# EasyEDA Pro project ProPrj_FinalPatch Design_2026-07-16.epro

# Schematic Schematic1
Board Name: Board1; Create Date: 2026-05-11; Page Name: P1; Project Name: FinalPatch Design; Schematic Name: Schematic1; Update Date: 2026-05-14; Company: EasyEDA.com; Page Size: A4; Version: V1.0
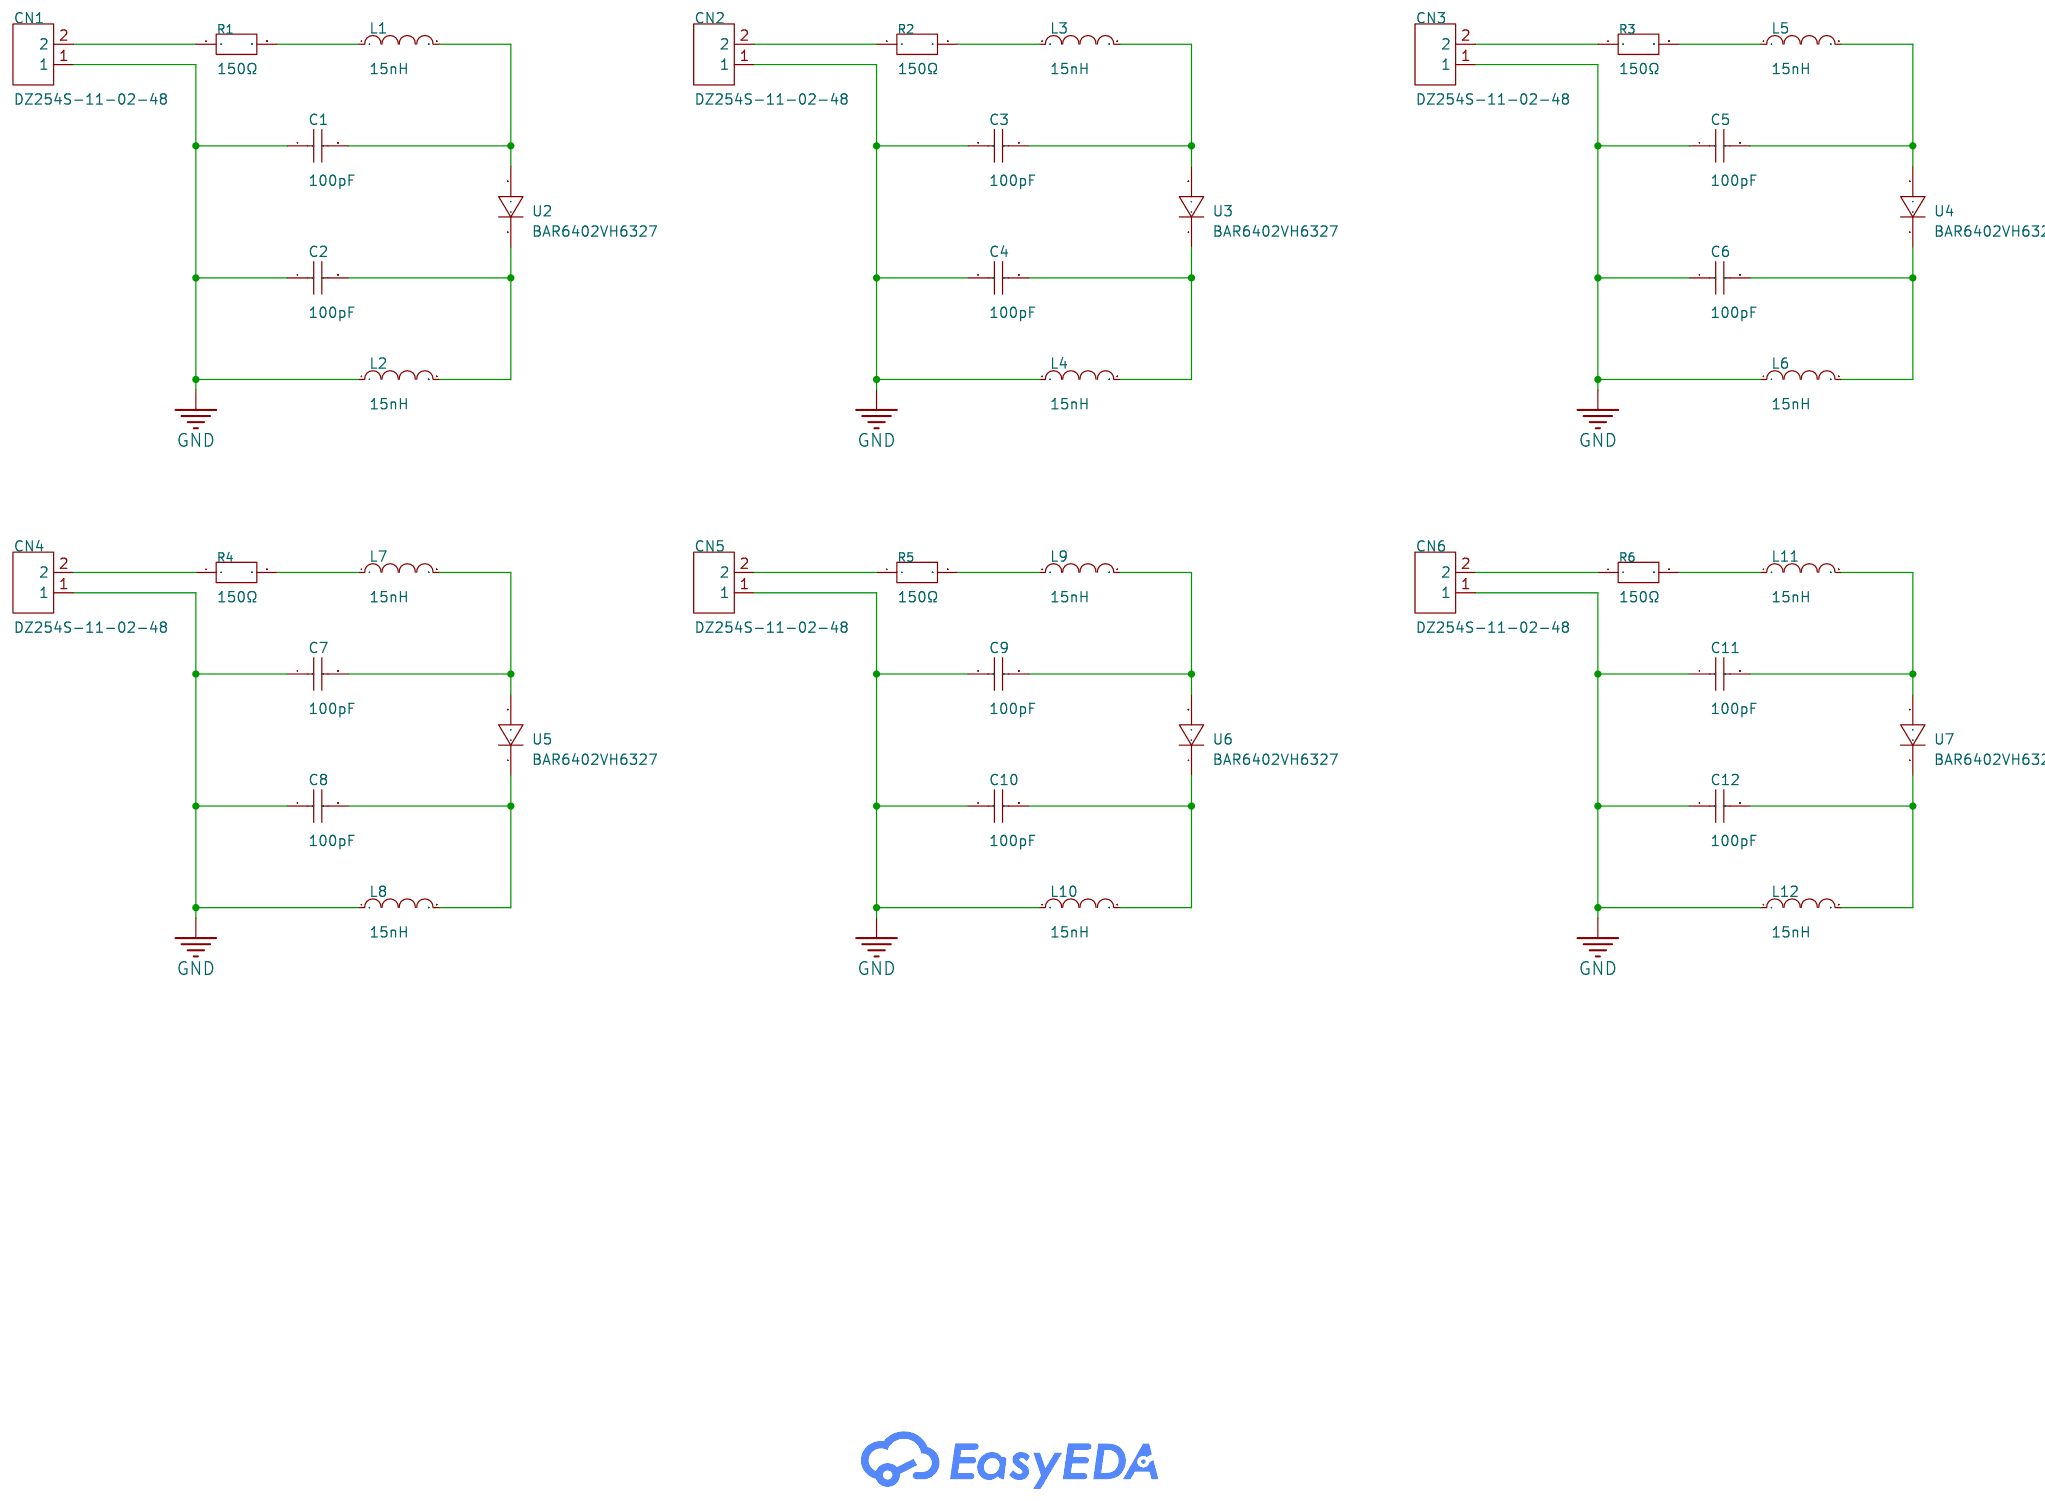
[diagram p0: schematic sheet]

## Parts
C1  100pF  [C0402]
C2  100pF  [C0402]
C3  100pF  [C0402]
C4  100pF  [C0402]
C5  100pF  [C0402]
C6  100pF  [C0402]
C7  100pF  [C0402]
C8  100pF  [C0402]
C9  100pF  [C0402]
C10  100pF  [C0402]
C11  100pF  [C0402]
C12  100pF  [C0402]
CN1  DZ254S-11-02-48  [HDR-SMD_2P-P2.54-LS4.8]
CN2  DZ254S-11-02-48  [HDR-SMD_2P-P2.54-LS4.8]
CN3  DZ254S-11-02-48  [HDR-SMD_2P-P2.54-LS4.8]
CN4  DZ254S-11-02-48  [HDR-SMD_2P-P2.54-LS4.8]
CN5  DZ254S-11-02-48  [HDR-SMD_2P-P2.54-LS4.8]
CN6  DZ254S-11-02-48  [HDR-SMD_2P-P2.54-LS4.8]
L1  15nH  [IND-SMD_L1.0-W0.6]
L2  15nH  [IND-SMD_L1.0-W0.6]
L3  15nH  [IND-SMD_L1.0-W0.6]
L4  15nH  [IND-SMD_L1.0-W0.6]
L5  15nH  [IND-SMD_L1.0-W0.6]
L6  15nH  [IND-SMD_L1.0-W0.6]
L7  15nH  [IND-SMD_L1.0-W0.6]
L8  15nH  [IND-SMD_L1.0-W0.6]
L9  15nH  [IND-SMD_L1.0-W0.6]
L10  15nH  [IND-SMD_L1.0-W0.6]
L11  15nH  [IND-SMD_L1.0-W0.6]
L12  15nH  [IND-SMD_L1.0-W0.6]
R1  150Ω  [R0603]
R2  150Ω  [R0603]
R3  150Ω  [R0603]
R4  150Ω  [R0603]
R5  150Ω  [R0603]
R6  150Ω  [R0603]
U2  BAR6402VH6327  [SC-79_L1.2-W0.8-LS1.6-RD]
U3  BAR6402VH6327  [SC-79_L1.2-W0.8-LS1.6-RD]
U4  BAR6402VH6327  [SC-79_L1.2-W0.8-LS1.6-RD]
U5  BAR6402VH6327  [SC-79_L1.2-W0.8-LS1.6-RD]
U6  BAR6402VH6327  [SC-79_L1.2-W0.8-LS1.6-RD]
U7  BAR6402VH6327  [SC-79_L1.2-W0.8-LS1.6-RD]

## Library data of the parts
C1-C12 = GRM1555C1H101JA01D: Capacitance:100pF Tolerance:±5% Tolerance:±5% Voltage Rating:50V Temperature Coefficient:C0G; LCSC Part Name: 100pF ±5% 50V; Supplier Part: C77177; Manufacturer: muRata(村田); Supplier Footprint: 0402; Datasheet: https://item.szlcsc.com/datasheet/GRM1555C1H101JA01D/78305.html; Supplier: LCSC; Tolerance: ±5%; Voltage Rating: 50V; Temperature Coefficient: C0G
CN1-CN6 = DZ254S-11-02-48: Pin Structure:1x2P Pitch:2.54mm Circluar Pins/Square Pins:Pin Header Mounting Type:Surface Mount,Vertical Number of Rows:1 Number of Pins:2P Current Rating:3A Length of Mating Pin:6mm Insulation Height:2.54mm Contact Material:Brass Contact Plating:Gold Co; LCSC Part Name: 1x2P 间距:2.54mm 方针 立贴; Supplier Part: C5160785; Manufacturer: DEALON(德艺隆); Supplier Footprint: SMD,P=2.54mm; JLCPCB Part Class: Extended Part; Datasheet: https://item.szlcsc.com/datasheet/DZ254S-11-02-48/5807881.html; Supplier: LCSC; Pin Structure: 1x2P; Pitch: 2.54mm; Circluar Pins/Square Pins: Pin Header; Mounting Type: Surface Mount,Vertical; Number of Rows: 1; Number of Pins: 2P; Current Rating: 3A; Length of Mating Pin: 6mm; Insulation Height: 2.54mm; Contact Material: Brass; Contact Plating: Gold; Color: Black
L1-L12 = LQW15AN15NJ00D: Inductance: Tolerance:±5% Tolerance:±5% Rated Current: Saturation Current (Isat):- DC Resistance (DCR): Ratings:-; LCSC Part Name: 15nH ±5%; Supplier Part: C94079; Manufacturer: muRata(村田); Supplier Footprint: 0402; Datasheet: https://atta.szlcsc.com/upload/public/pdf/source/20170325/1490427896379.pdf; Supplier: LCSC; Tolerance: ±5%
R1-R6 = HP03W5F1500T5E: Type:Thick Film Resistor Resistance:150Ω Tolerance:±1% Tolerance:±1% Power(Watts):200mW Voltage-Supply(Max):75V Temperature Coefficient:±100ppm/℃ Temperature Coefficient:±100ppm/℃ Operating Temperature:-55℃~+155℃ Operating Temperature:-55℃~+155℃; LCSC Part Name: 150Ω ±1% 200mW 厚膜电阻; Supplier Part: C778412; Manufacturer: UNI-ROYAL(厚声); Supplier Footprint: 0603; Datasheet: https://item.szlcsc.com/datasheet/HP03W5F1500T5E/827056.html; Supplier: LCSC; Type: Thick Film Resistor; Tolerance: ±1%; Power(Watts): 200mW; Voltage-Supply(Max): 75V; Temperature Coefficient: ±100ppm/℃; Operating Temperature: -55℃~+155℃
U2-U7 = BAR6402VH6327: LCSC Part Name: 硅PIN二极管，高压电流控制射频电阻，频率范围1 MHz - 6 GHz; Supplier Part: C115495; Manufacturer: Infineon(英飞凌); Supplier Footprint: SC-79; JLCPCB Part Class: Extended Part; Datasheet: https://item.szlcsc.com/datasheet/BAR6402VH6327/116743.html; Supplier: LCSC

## Nets
GND: C1.1 C2.1 C3.1 C4.1 C5.1 C6.1 C7.1 C8.1 C9.1 C10.1 C11.1 C12.1 CN1.1 CN2.1 CN3.1 CN4.1 CN5.1 CN6.1 L2.1 L4.1 L6.1 L8.1 L10.1 L12.1
$1N3898: CN1.2 R1.1
$1N4274: C1.2 L1.2 U2.2(K)
$1N4289: L1.1 R1.2
$1N4357: C2.2 L2.2 U2.1(A)
$1N8168: L3.1 R2.2
$1N8170: C3.2 L3.2 U3.2(K)
$1N8175: C4.2 L4.2 U3.1(A)
$1N8189: CN2.2 R2.1
$1N8448: L5.1 R3.2
$1N8450: C5.2 L5.2 U4.2(K)
$1N8455: C6.2 L6.2 U4.1(A)
$1N8469: CN3.2 R3.1
$1N9242: L7.1 R4.2
$1N9244: C7.2 L7.2 U5.2(K)
$1N9249: C8.2 L8.2 U5.1(A)
$1N9263: CN4.2 R4.1
$1N9273: CN5.2 R5.1
$1N9274: C9.2 L9.2 U6.2(K)
$1N9279: C10.2 L10.2 U6.1(A)
$1N9284: L9.1 R5.2
$1N9286: C11.2 L11.2 U7.2(K)
$1N9291: C12.2 L12.2 U7.1(A)
$1N9305: L11.1 R6.2
$1N9307: CN6.2 R6.1

# Board PCB1
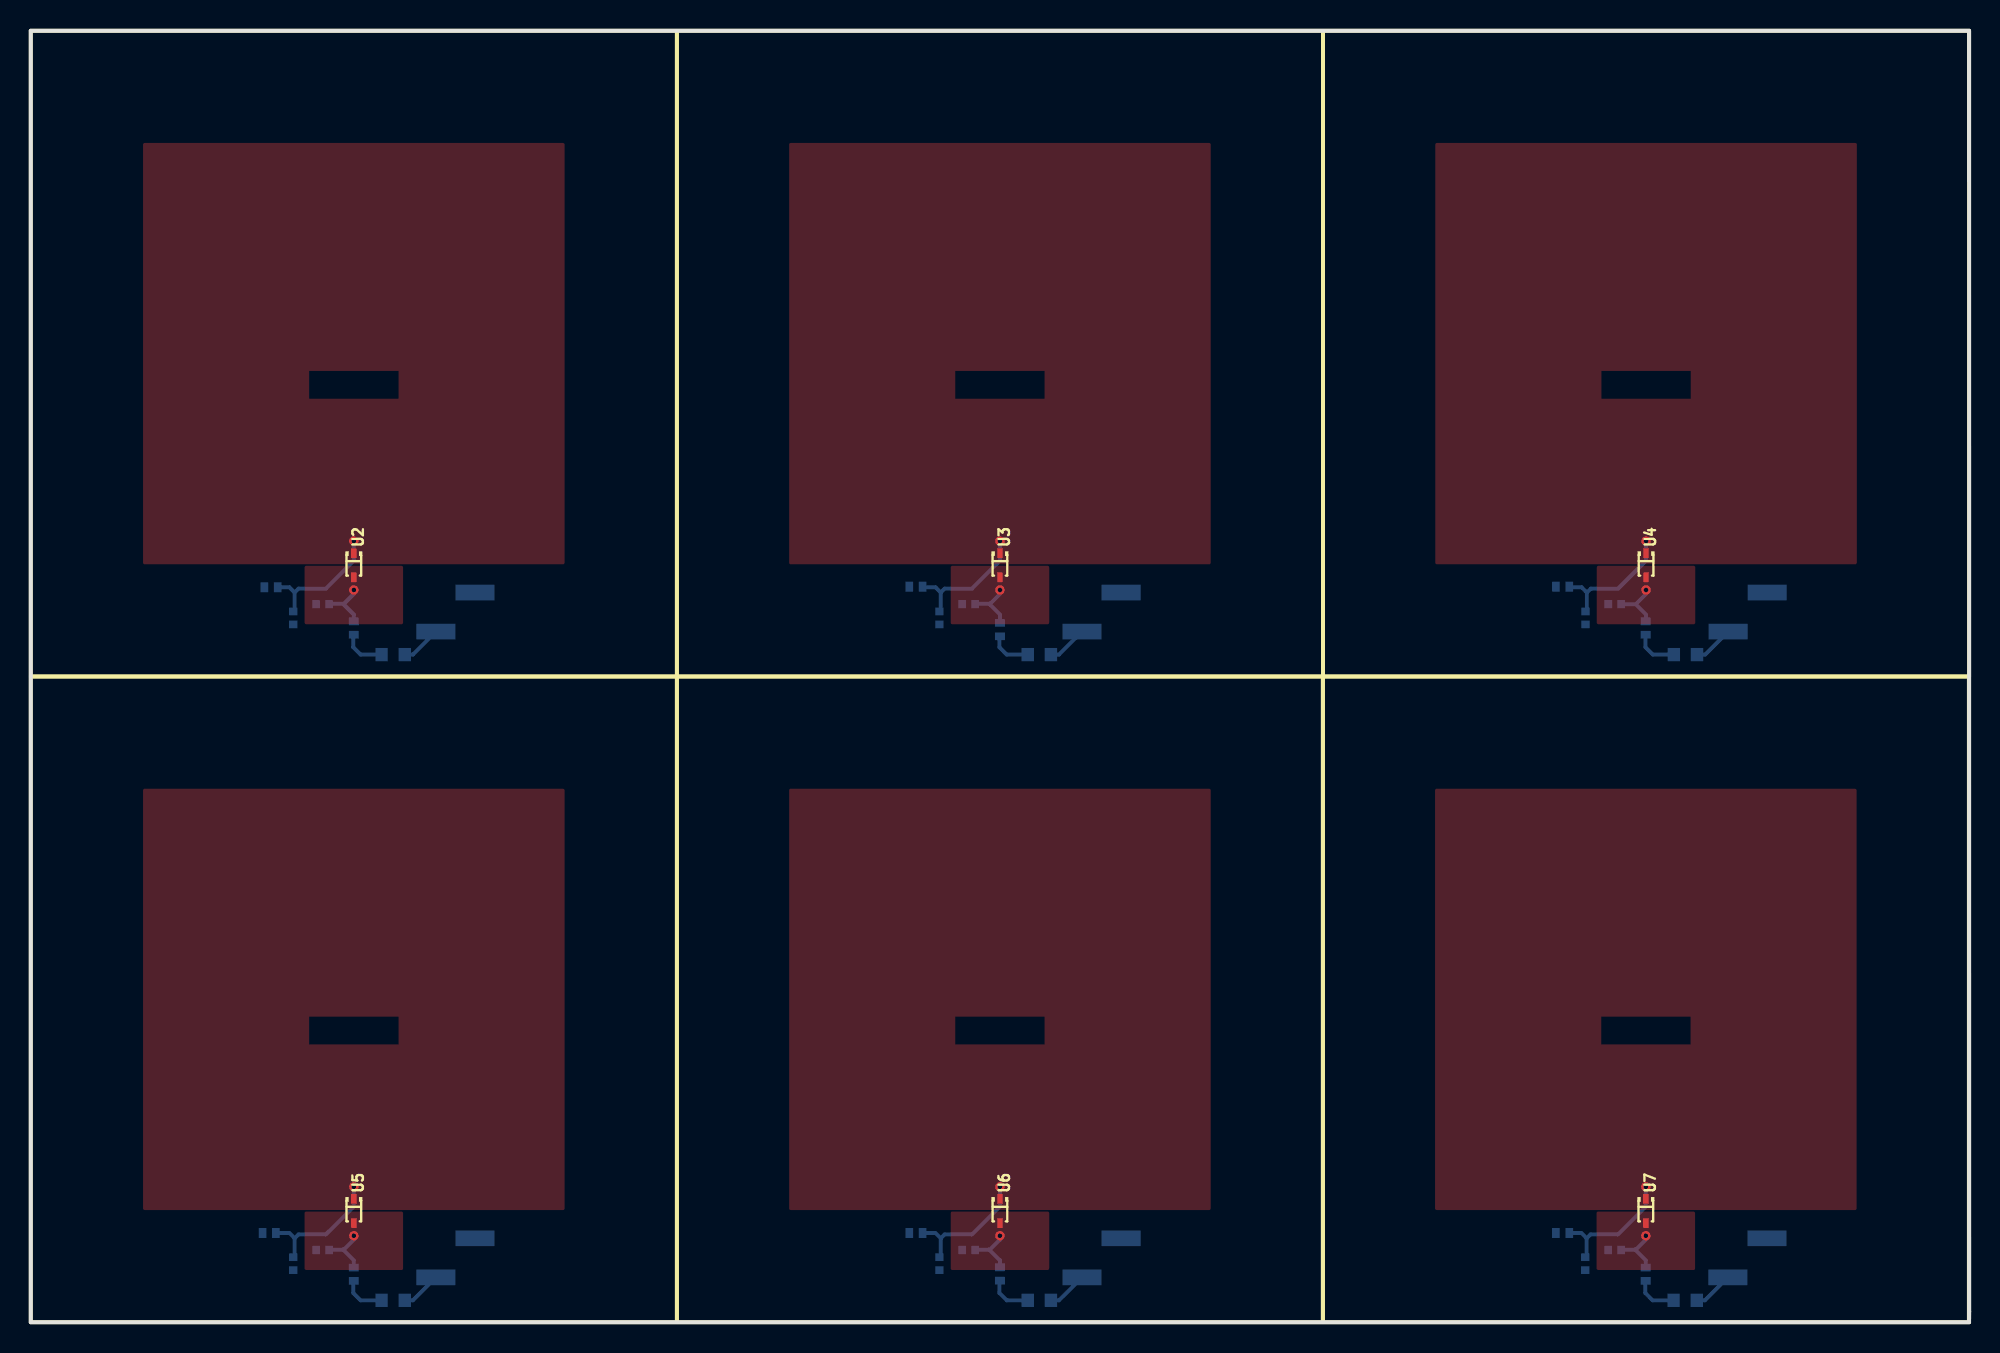
[diagram p1: board, top side]
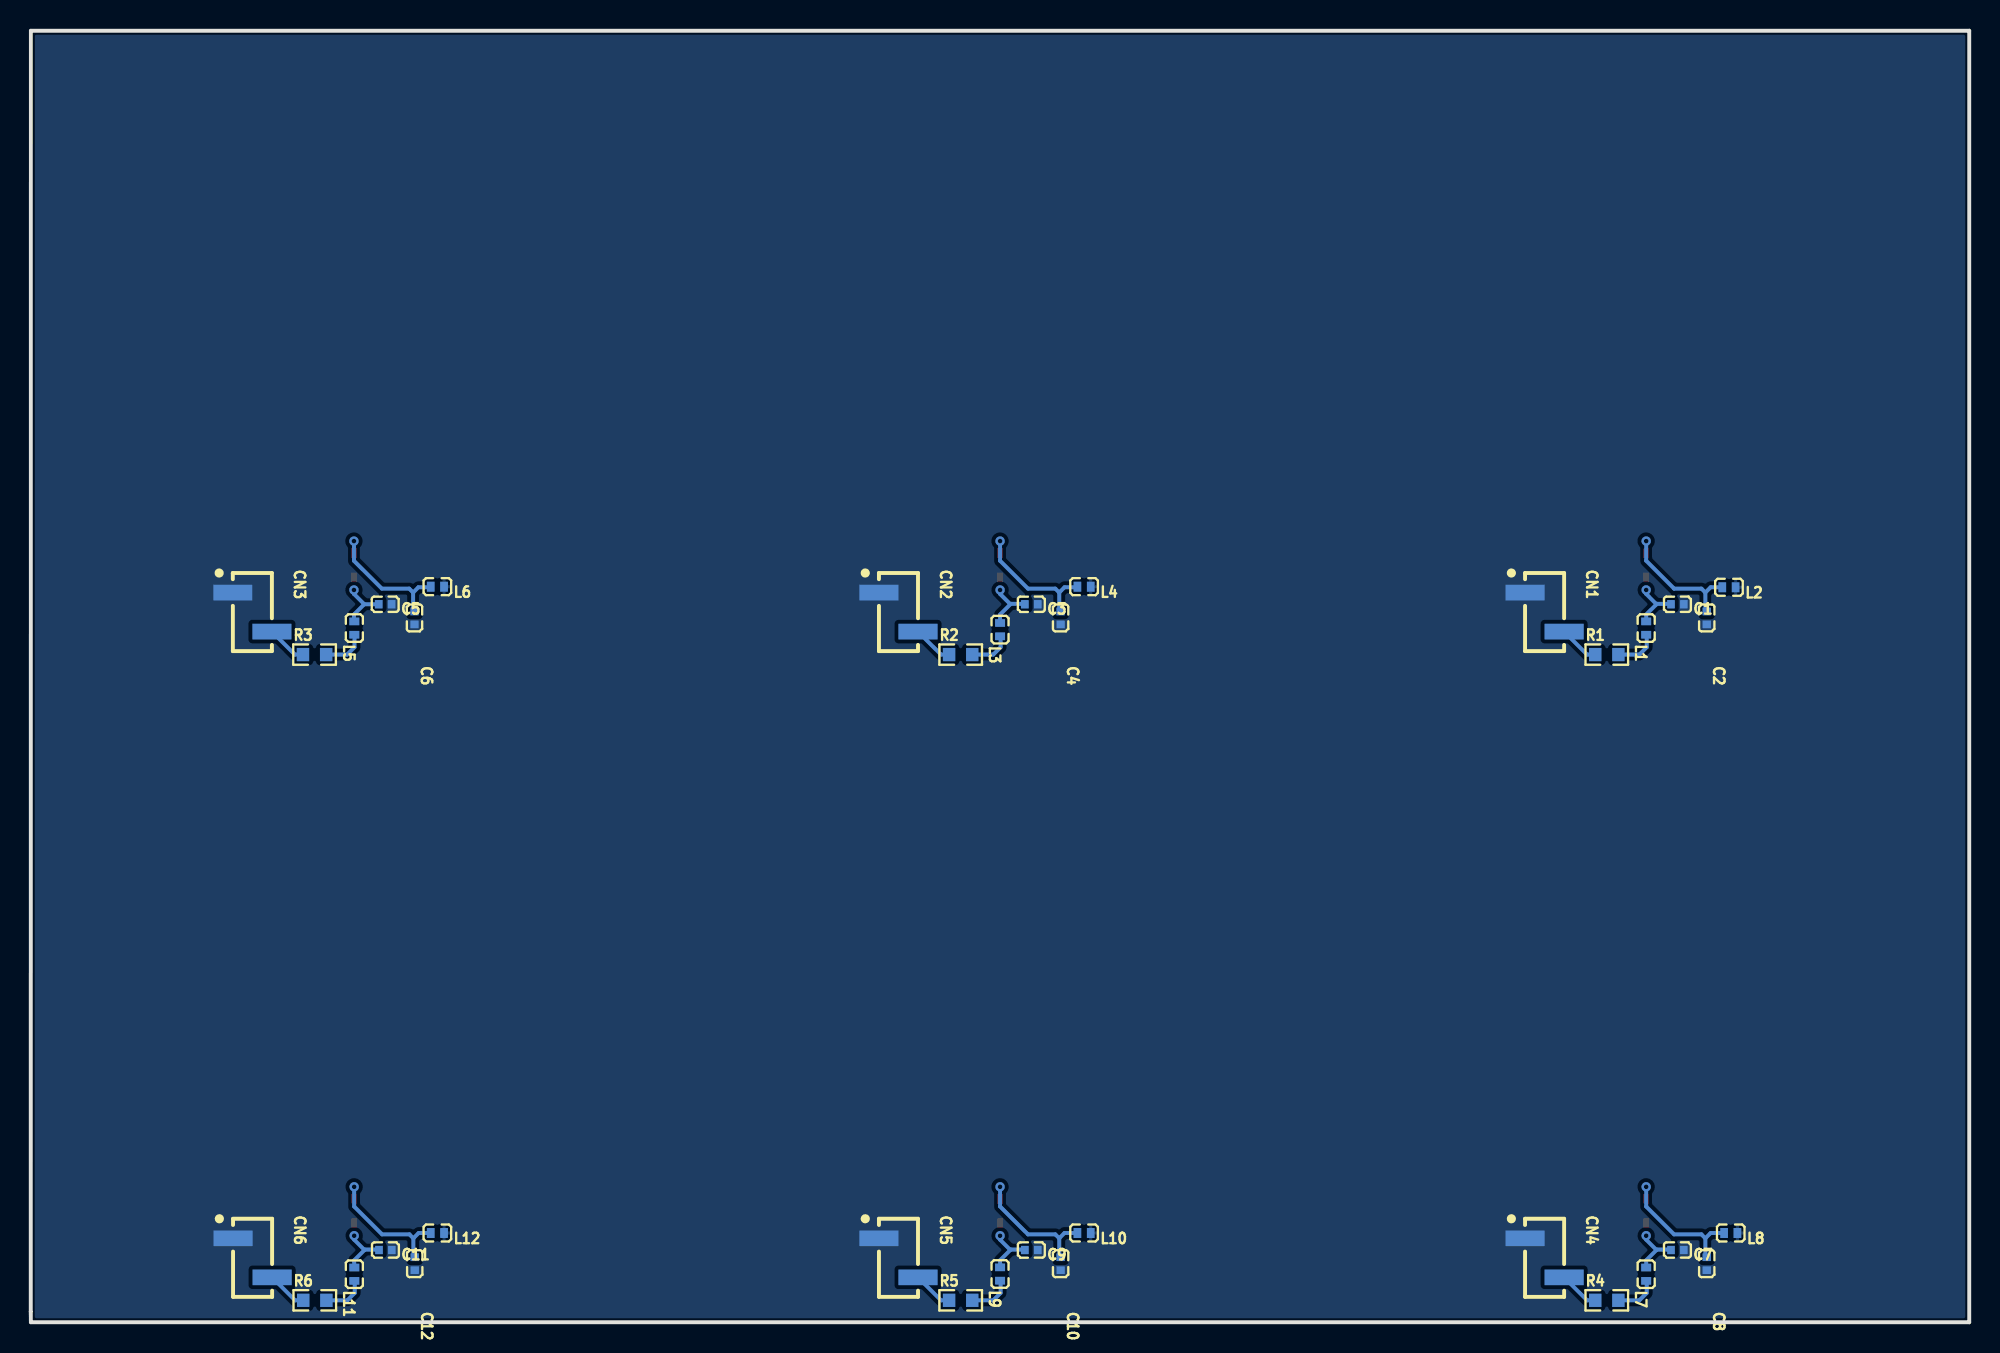
[diagram p2: board, bottom side, seen from below]

Outline 126.01 x 84 mm; copper layers: Top Layer, Bottom Layer. Coordinates in mm from the lower left corner of the outline.
Outline path: 0,84 0,0 126,0 126.01,0.67 126,84 0,84
Stack: Top Layer 0.035mm / Dielectric1 1.6mm FR4 er 4.5 / Bottom Layer 0.035mm

## Design rules (mm)
template: Custom Config
spacing copperThickness1oz (default): track to track 0.102, other pairs 0 to 0.3
spacing copperThickness2oz: track to track 0.203, other pairs 0.152 to 0.3
spacing safeClearance1: track to track 0.152, other pairs 0 to 0.3
track width copperThickness1oz (default): min 0.127, default 0.254, max 2.54
track width copperThickness2oz: min 0.203, default 0.254, max 2.54
differential pair differentialPair (default): width min 0.127, default 0.254, max 2.54; gap min 0.152, default 0.152
via viaSize (default): diameter min 0.5, default 0.61, max 10; hole min 0.3, default 0.305, max 6.3

## Placement (name value [footprint] x y rotation side)
C1  100pF  [C0402]  18.97 46.7 0 bottom
C2  100pF  [C0402]  17.06 45.81 90 bottom
C3  100pF  [C0402]  60.97 46.7 0 bottom
C4  100pF  [C0402]  59.06 45.81 90 bottom
C5  100pF  [C0402]  102.97 46.7 0 bottom
C6  100pF  [C0402]  101.06 45.81 90 bottom
C7  100pF  [C0402]  18.97 4.7 0 bottom
C8  100pF  [C0402]  17.06 3.81 90 bottom
C9  100pF  [C0402]  60.97 4.7 0 bottom
C10  100pF  [C0402]  59.06 3.81 90 bottom
C11  100pF  [C0402]  102.95 4.7 0 bottom
C12  100pF  [C0402]  101.05 3.81 90 bottom
CN1  DZ254S-11-02-48  [HDR-SMD_2P-P2.54-LS4.8]  27.6 46.19 270 bottom
CN2  DZ254S-11-02-48  [HDR-SMD_2P-P2.54-LS4.8]  69.6 46.19 270 bottom
CN3  DZ254S-11-02-48  [HDR-SMD_2P-P2.54-LS4.8]  111.6 46.19 270 bottom
CN4  DZ254S-11-02-48  [HDR-SMD_2P-P2.54-LS4.8]  27.6 4.19 270 bottom
CN5  DZ254S-11-02-48  [HDR-SMD_2P-P2.54-LS4.8]  69.6 4.19 270 bottom
CN6  DZ254S-11-02-48  [HDR-SMD_2P-P2.54-LS4.8]  111.59 4.19 270 bottom
L1  15nH  [IND-SMD_L1.0-W0.6]  21 45.15 90 bottom
L2  15nH  [IND-SMD_L1.0-W0.6]  15.62 47.8 0 bottom
L3  15nH  [IND-SMD_L1.0-W0.6]  63 45.05 90 bottom
L4  15nH  [IND-SMD_L1.0-W0.6]  57.54 47.84 0 bottom
L5  15nH  [IND-SMD_L1.0-W0.6]  104.97 45.15 90 bottom
L6  15nH  [IND-SMD_L1.0-W0.6]  99.58 47.84 0 bottom
L7  15nH  [IND-SMD_L1.0-W0.6]  21 3.12 90 bottom
L8  15nH  [IND-SMD_L1.0-W0.6]  15.5 5.81 0 bottom
L9  15nH  [IND-SMD_L1.0-W0.6]  63 3.14 90 bottom
L10  15nH  [IND-SMD_L1.0-W0.6]  57.54 5.81 0 bottom
L11  15nH  [IND-SMD_L1.0-W0.6]  104.97 3.12 90 bottom
L12  15nH  [IND-SMD_L1.0-W0.6]  99.58 5.81 0 bottom
R1  150Ω  [R0603]  23.56 43.43 180 bottom
R2  150Ω  [R0603]  65.56 43.43 180 bottom
R3  150Ω  [R0603]  107.56 43.43 180 bottom
R4  150Ω  [R0603]  23.56 1.43 180 bottom
R5  150Ω  [R0603]  65.56 1.43 180 bottom
R6  150Ω  [R0603]  107.55 1.43 180 bottom
U2  BAR6402VH6327  [SC-79_L1.2-W0.8-LS1.6-RD]  21 49.24 270 top
U3  BAR6402VH6327  [SC-79_L1.2-W0.8-LS1.6-RD]  63 49.24 270 top
U4  BAR6402VH6327  [SC-79_L1.2-W0.8-LS1.6-RD]  105 49.24 270 top
U5  BAR6402VH6327  [SC-79_L1.2-W0.8-LS1.6-RD]  21 7.24 270 top
U6  BAR6402VH6327  [SC-79_L1.2-W0.8-LS1.6-RD]  63 7.24 270 top
U7  BAR6402VH6327  [SC-79_L1.2-W0.8-LS1.6-RD]  104.99 7.24 270 top

## Footprints (pads in the part's own frame, mm; a bottom-side part is the same pattern mirrored in y, then rotated)
C0402
  rect 0.5x0.54 smd: 1(-0.42,0) 2(0.42,0)
HDR-SMD_2P-P2.54-LS4.8
  rect 1.02x2.54 smd: 1(-1.27,-1.27) 2(1.27,1.27)
IND-SMD_L1.0-W0.6
  rect 0.5x0.648 smd: 1(-0.434,0) 2(0.434,0)
R0603
  rect 0.806x0.864 smd: 1(-0.753,0) 2(0.753,0)
SC-79_L1.2-W0.8-LS1.6-RD
  rect 0.63x0.36 smd: 1(-0.785,0) 2(0.785,0)

## Nets
As in the schematic.

## Via types
v1: diameter 0.61, hole 0.305, Top Layer to Bottom Layer, 12 vias

## Routing (per net, layer and track width the routed paths; a pad name or vN(x,y) marks a point on that pad's centre or on a via; arc(x,y) is an arc through that point)
$1N3898: length 2.6
  Bottom Layer w0.254: R1.1 24.84,43.43 CN1.2
$1N4274: length 3.6
  Bottom Layer w0.254: L1.2 21,46.03 20.33,46.7 ; v1(21,47.63) 21,47.37 20.33,46.7 ; 20.33,46.7 20.3,46.73 19.42,46.73 C1.2
$1N4289: length 2.9
  Bottom Layer w0.254: L1.1 20.96,44.68 20.96,43.91 21.44,43.43 R1.2
$1N4357: length 8.5
  Bottom Layer w0.254: 17.15,47.46 17.15,46.32 C2.2 ; 17.15,47.46 17.41,47.72 19.19,47.72 21,49.53 v1(21,50.81) ; 17.15,47.46 16.81,47.8 L2.2
$1N8168: length 2.9
  Bottom Layer w0.254: R2.2 63.44,43.43 62.96,43.91 62.96,44.68 63,44.72
$1N8170: length 3.6
  Bottom Layer w0.254: 62.33,46.7 63,47.37 v1(63,47.63) ; 62.33,46.7 63,46.03 63,45.58 ; 62.33,46.7 62.3,46.73 61.42,46.73 C3.2
$1N8175: length 8.5
  Bottom Layer w0.254: 58.05,47.8 58.81,47.8 59.15,47.46 ; 59.15,47.46 59.41,47.72 61.19,47.72 63,49.53 v1(63,50.81) ; 59.15,47.46 59.15,46.32 C4.2
$1N8189: length 2.6
  Bottom Layer w0.254: CN2.2 66.84,43.43 R2.1
$1N8448: length 2.9
  Bottom Layer w0.254: R3.2 105.44,43.43 104.96,43.91 104.96,44.68 105,44.72
$1N8450: length 3.5
  Bottom Layer w0.254: v1(105,47.63) 105,47.37 104.33,46.7 ; 104.33,46.7 C5.2 ; 104.33,46.7 105,46.03 105,45.58
$1N8455: length 8.5
  Bottom Layer w0.254: v1(105,50.81) 105,49.53 103.19,47.72 101.41,47.72 101.15,47.46 ; 101.15,47.46 101.15,46.32 C6.2 ; 101.15,47.46 100.81,47.8 100.05,47.8
$1N8469: length 2.6
  Bottom Layer w0.254: CN3.2 108.84,43.43 R3.1
$1N9242: length 2.9
  Bottom Layer w0.254: 21,2.72 20.96,2.68 20.96,1.91 21.44,1.43 R4.2
$1N9244: length 3.6
  Bottom Layer w0.254: v1(21,5.63) 21,5.37 20.33,4.7 ; 20.33,4.7 21,4.03 21,3.58 ; 20.33,4.7 20.3,4.73 19.42,4.73 C7.2
$1N9249: length 8.5
  Bottom Layer w0.254: 17.15,5.46 17.41,5.72 19.19,5.72 21,7.53 v1(21,8.81) ; 17.15,5.46 17.15,4.32 C8.2 ; 17.15,5.46 16.81,5.8 16.05,5.8
$1N9263: length 2.6
  Bottom Layer w0.254: CN4.2 24.84,1.43 R4.1
$1N9273: length 2.6
  Bottom Layer w0.254: CN5.2 66.84,1.43 R5.1
$1N9274: length 3.6
  Bottom Layer w0.254: 62.33,4.7 63,4.03 63,3.58 ; 62.33,4.7 62.3,4.73 61.42,4.73 C9.2 ; 62.33,4.7 63,5.37 v1(63,5.63)
$1N9279: length 8.5
  Bottom Layer w0.254: C10.2 59.15,4.32 59.15,5.46 ; v1(63,8.81) 63,7.53 61.19,5.72 59.41,5.72 59.15,5.46 ; 59.15,5.46 58.81,5.8 58.05,5.8
$1N9284: length 2.9
  Bottom Layer w0.254: 63,2.72 62.96,2.68 62.96,1.91 63.44,1.43 R5.2
$1N9286: length 3.6
  Bottom Layer w0.254: C11.2 103.4,4.73 104.29,4.73 104.31,4.7 ; 104.31,4.7 104.99,4.03 104.99,3.58 ; 104.31,4.7 104.99,5.37 v1(104.99,5.63)
$1N9291: length 8.5
  Bottom Layer w0.254: 100.04,5.8 100.8,5.8 101.14,5.46 ; 101.14,5.46 101.39,5.72 103.17,5.72 104.99,7.53 v1(104.99,8.81) ; 101.14,5.46 101.14,4.32 C12.2
$1N9305: length 2.9
  Bottom Layer w0.254: R6.2 105.43,1.43 104.95,1.91 104.95,2.68 104.99,2.72
$1N9307: length 2.6
  Bottom Layer w0.254: R6.1 108.82,1.43 CN6.2

## Copper pours and planes (outline as drawn; the poured copper is in the pictures)
GND on Bottom Layer: -0.5,84.37 126.5,84.37 126.5,-0.63 -0.5,-0.63
$1N4274 on Top Layer: 17.9,49.1 24.1,49.1 24.1,45.5 17.9,45.5
$1N4357 on Top Layer: 7.4,76.6 34.6,76.6 34.6,49.4 7.4,49.4
$1N8170 on Top Layer: 59.9,49.1 66.1,49.1 66.1,45.5 59.9,45.5
$1N8175 on Top Layer: 49.4,76.6 76.6,76.6 76.6,49.4 49.4,49.4
$1N8450 on Top Layer: 101.9,49.1 108.1,49.1 108.1,45.5 101.9,45.5
$1N8455 on Top Layer: 91.4,76.6 118.6,76.6 118.6,49.4 91.4,49.4
$1N9244 on Top Layer: 17.9,7.1 24.1,7.1 24.1,3.5 17.9,3.5
$1N9249 on Top Layer: 7.4,34.6 34.6,34.6 34.6,7.4 7.4,7.4
$1N9274 on Top Layer: 59.9,7.1 66.1,7.1 66.1,3.5 59.9,3.5
$1N9279 on Top Layer: 49.4,34.6 76.6,34.6 76.6,7.4 49.4,7.4
$1N9286 on Top Layer: 101.89,7.1 108.09,7.1 108.09,3.5 101.89,3.5
$1N9291 on Top Layer: 91.39,34.6 118.59,34.6 118.59,7.4 91.39,7.4
